# EAGLE design licznik (EAGLE 7.5.0)
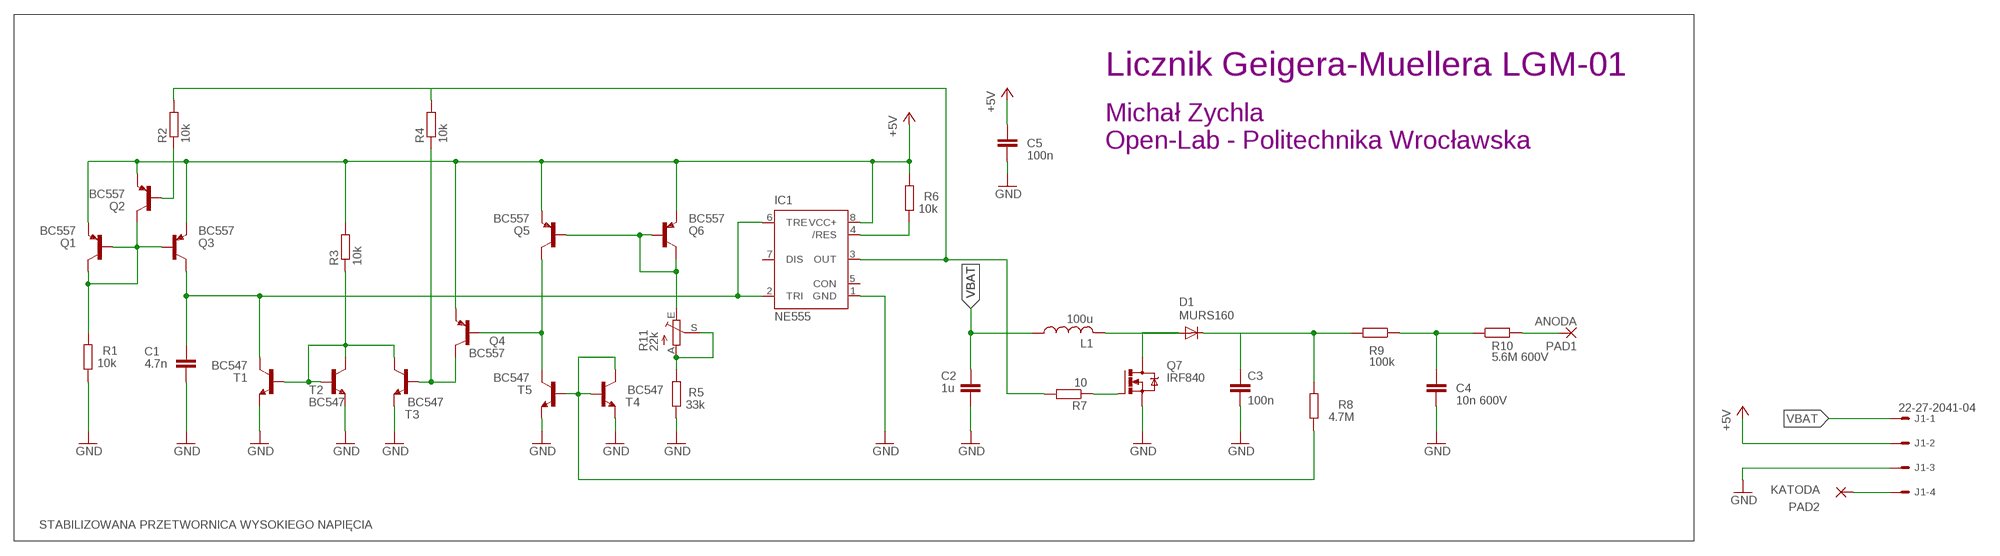
[diagram p0: schematic, sheet 1]

## Parts
C1  4.7n  C5/3  [C5B3]
C2  1u  C5/3  [C5B3]
C3  100n  C-EU075-032X103  [C075-032X103]
C4  10n 600V  C5/3  [C5B3]
C5  100n  C5/3  [C5B3]
D1  MURS160  DIODE-SMB  [SMB]
IC1  NE555  [DIL-08]
J1  22-27-2041-04  [6410-04]
L1  100u  L-USTJ3-U1  [TJ3-U1]
PAD1  ANODA  WIREPAD2,15/1,0  [2,15/1,0]
PAD2  KATODA  WIREPAD2,15/1,0  [2,15/1,0]
Q1  BC557  [TO92]
Q2  BC557  [TO92]
Q3  BC557  [TO92]
Q4  BC557  [TO92]
Q5  BC557  [TO92]
Q6  BC557  [TO92]
Q7  IRF840  IRF740  [TO220BV]
R1  10k  R-EU_0207/10  [0207/10]
R2  10k  R-EU_0207/10  [0207/10]
R3  10k  R-EU_0207/10  [0207/10]
R4  10k  R-EU_0207/10  [0207/10]
R5  33k  R-EU_0207/10  [0207/10]
R6  10k  R-EU_0207/10  [0207/10]
R7  10  R-EU_0207/10  [0207/10]
R8  4.7M  R-EU_0207/10  [0207/10]
R9  100k  R-EU_0207/10  [0207/10]
R10  5.6M 600V  R-EU_0411/12  [0411/12]
R11  22k  TRIM_EU-CA6V  [CA6V]
T1  BC547  [TO92]
T2  BC547  [TO92]
T3  BC547  [TO92]
T4  BC547  [TO92]
T5  BC547  [TO92]

## Nets
+5V: C5.1 IC1.8(VCC+) J1.2 Q1.1(E) Q2.1(E) Q3.1(E) Q4.1(E) Q5.1(E) Q6.1(E) R3.2 R6.2
GND: C1.2 C2.2 C3.2 C4.2 C5.2 IC1.1(GND) J1.3 Q7.S R1.1 R5.1 T1.1(E) T2.1(E) T3.1(E) T4.1(E) T5.1(E)
N$1: C3.1 D1.C R8.2 R9.2
N$2: Q4.3(C) R4.1 T3.2(B)
N$3: IC1.3(OUT) R2.2 R4.2 R7.2
N$4: Q1.2(B) Q1.3(C) Q2.3(C) Q3.2(B) R1.2
N$5: C1.1 IC1.2(TRI) IC1.6(TRE) Q3.3(C) T1.3(C)
N$6: D1.A L1.2 Q7.D
N$7: R3.1 T1.2(B) T2.2(B) T2.3(C) T3.3(C)
N$8: Q2.2(B) R2.1
N$9: Q7.G R7.1
N$10: C4.1 R9.1 R10.1
N$11: Q5.2(B) Q6.2(B) Q6.3(C) R11.E
N$12: R8.1 T4.2(B) T5.2(B) T5.3(C)
N$13: Q4.2(B) Q5.3(C) T4.3(C)
N$14: R5.2 R11.A R11.S
N$16: IC1.4(/RES) R6.1
N$25: PAD1.1(P) R10.2
N$26: J1.4 PAD2.1(P)
VBAT: C2.1 J1.1 L1.1
Unconnected: IC1.5(CON) IC1.7(DIS)

## Notes on the sheet
- Licznik Geigera-Muellera LGM-01
- Michał Zychla
  Open-Lab - Politechnika Wrocławska
- STABILIZOWANA PRZETWORNICA WYSOKIEGO NAPIĘCIA

## Library data of the parts
C1 C2 C4 C5 = capacitor-wima:C: CAPACITOR naming: grid - package width
C3 = rcl:C-EU: CAPACITOR, European symbol
D1 = diode:DIODE-: DIODE
IC1 = st-microelectronics:NE555: General purpose bipolar Timer; MF: Arrow Electronics; MPN: NE555N; OC_FARNELL: 1467742; OC_NEWARK: 89K1486
J1 = con-molex:22-?-04: CONNECTOR wire to board 2.54 mm (.1 inch) pitch header; OC_FARNELL: unknown; OC_NEWARK: unknown
L1 = rcl:L-US: INDUCTOR, American symbol
PAD1 PAD2 = wirepad:WIREPAD: Wire PAD connect wire on PCB
Q1-Q6 = transistor-pnp:BC557: PNP Transistor
Q7 = transistor-power:IRF740: N-CHANNEL MOS FET
R1-R10 = resistor:R-EU_: RESISTOR, European symbol
R11 = pot:TRIM_EU-: POTENTIOMETER
T1-T5 = transistor:BC547: NPN TRANSISTOR

## Board
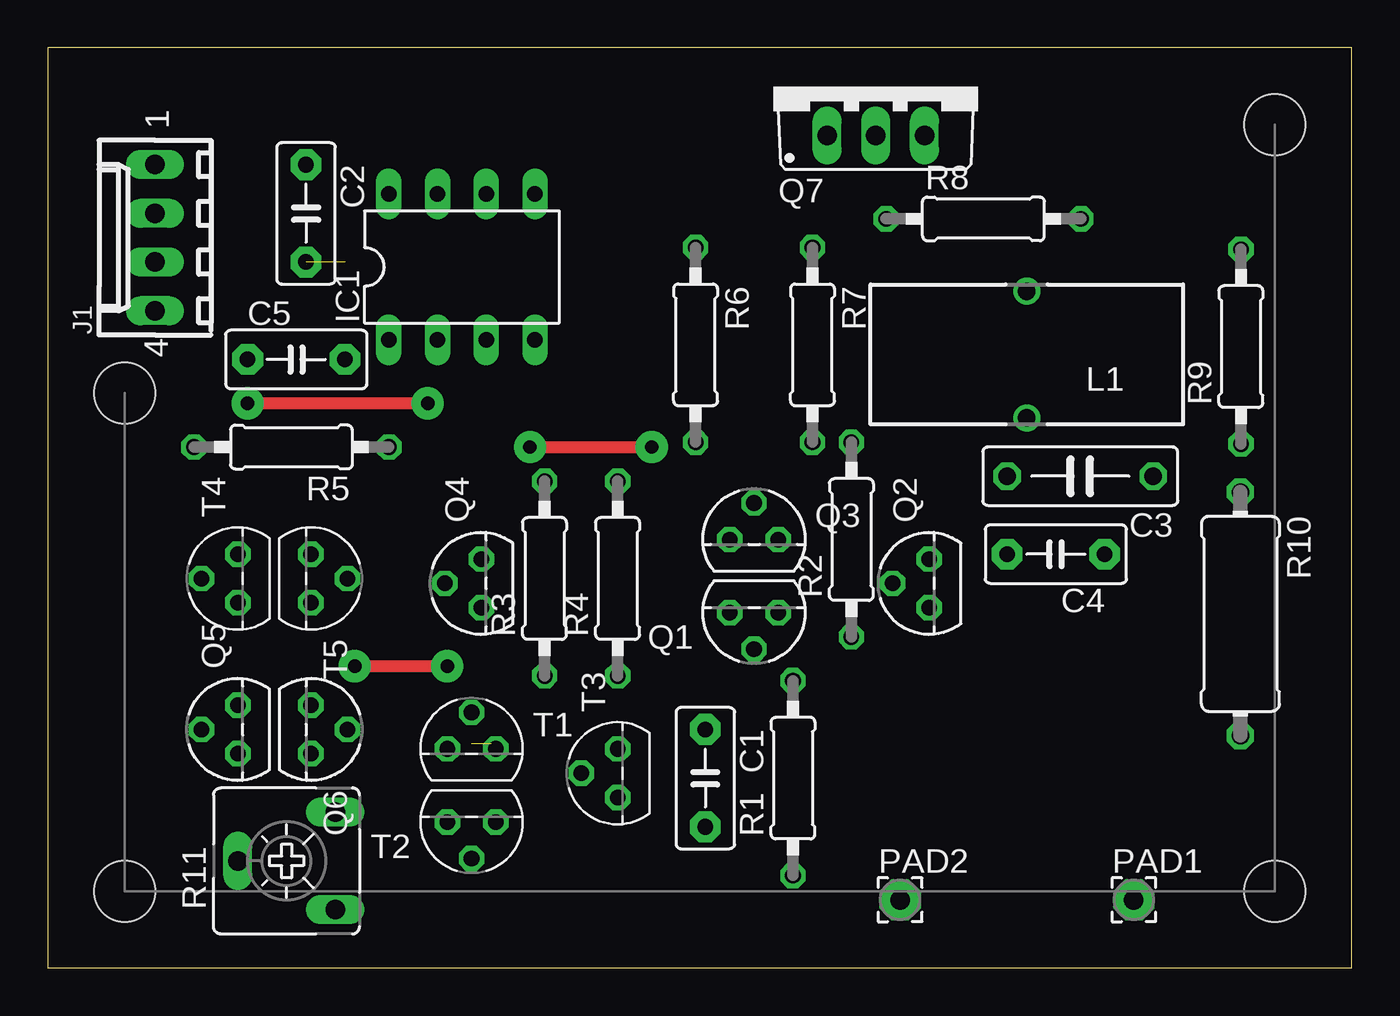
[diagram p1: board, top side]
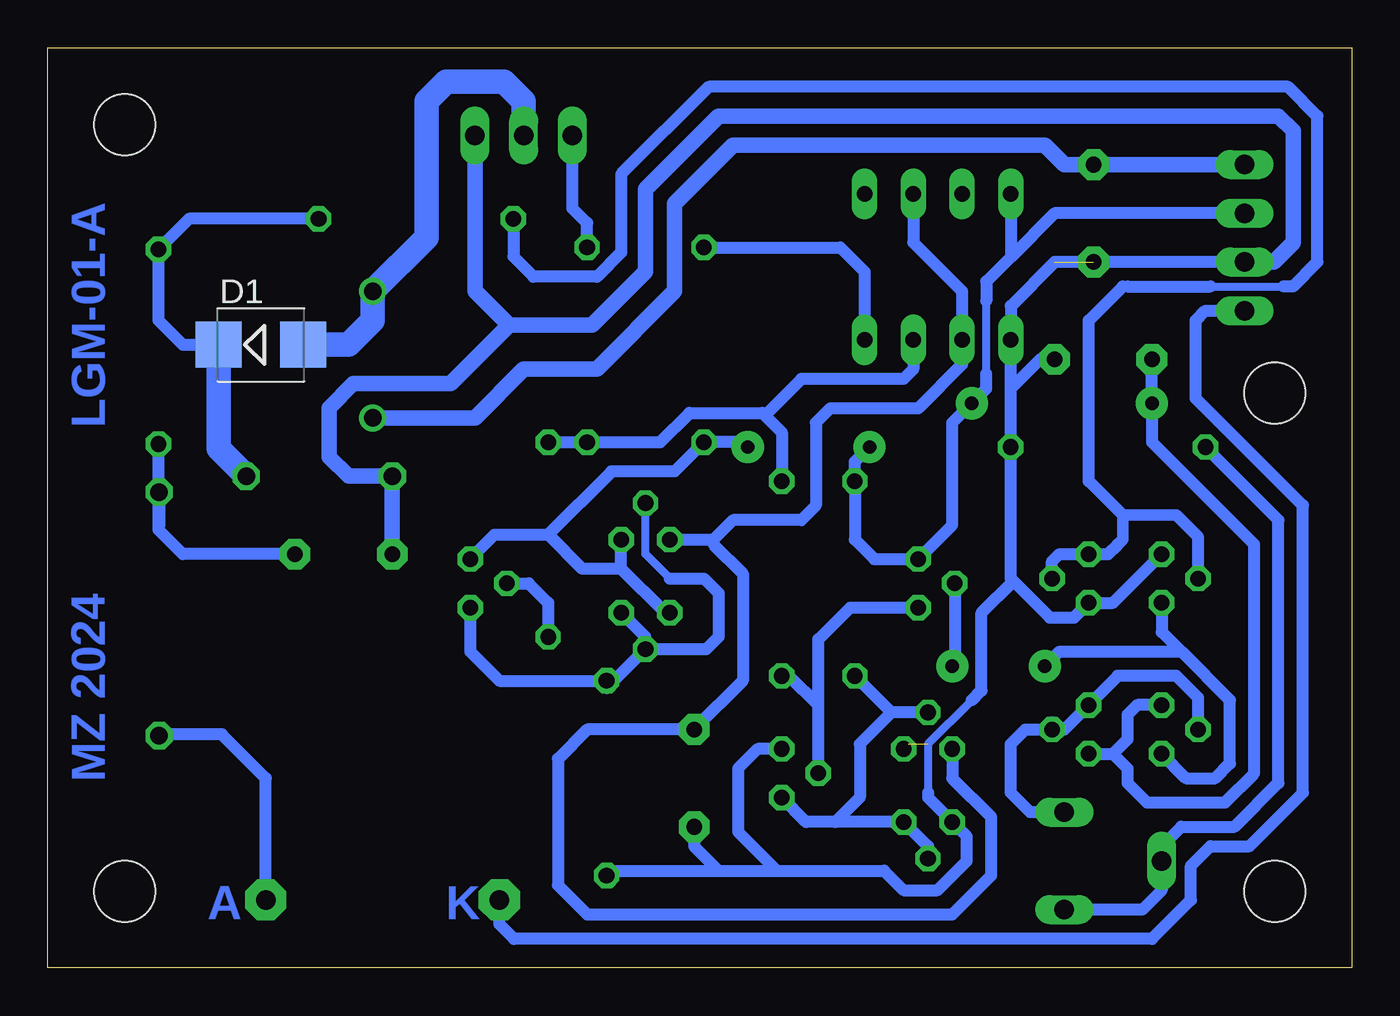
[diagram p2: board, bottom side, seen from below]

Size 68 x 48 mm. Coordinates in mm from the lower left corner, seen from the top.
Outline: 0,0 68,0 68,48 0,48 0,0
Copper layers (1*16): Top 0.035mm / dielectric 1.5mm / Bottom 0.035mm
Design rules "default": minimum track width 10mil, minimum drill 24mil, track to track 8mil, track to pad 8mil, pad to pad 8mil, via to via 8mil, smd to smd 8mil, copper to edge 40mil, drill to drill 8mil, minimum pad ring 10mil, minimum via ring 8mil, stop-mask expansion 4mil, vias tented up to drill 0mil, thermal gap 10mil
Holes 3.2 mm at 4,4 64,44 4,30 64,4

### Footprints (pad centres in the part's own frame; a part is rotated, then mirrored left to right if it is on the bottom)
C5B3 = drill 0.813 pad 1.6 octagon: 1 -2.54,0; 2 2.54,0
C075-032X103 = drill 0.914 octagon: 1 -3.81,0; 2 3.81,0
SMB = smd 2.4 x 2.4: A 2.2,0; C -2.2,0
DIL-08 = drill 0.813 long: 1 -3.81,-3.81; 2 -1.27,-3.81; 3 1.27,-3.81; 4 3.81,-3.81; 5 3.81,3.81; 6 1.27,3.81; 7 -1.27,3.81; 8 -3.81,3.81
6410-04 = drill 1.016 long: 1 3.81,0; 2 1.27,0; 3 -1.27,0; 4 -3.81,0
TJ3-U1 = drill 0.9: 1 -3.3,0; 2 3.3,0
2,15/1,0 = drill 1.016 pad 2.159 octagon: 1 0,0
TO92 = drill 0.813 octagon: 1 1.27,0; 2 0,1.905; 3 -1.27,0
TO220BV = drill 1.016 long: D 0,-2.54; G -2.54,-2.54; S 2.54,-2.54
0207/10 = drill 0.813 octagon: 1 -5.08,0; 2 5.08,0
0411/12 = drill 0.914 octagon: 1 -6.35,0; 2 6.35,0
CA6V = drill 1.016 long: A -2.54,-2.54; E 2.54,-2.54; S 0,2.54

### Placement (x,y rotation side)
C1  34.29,9.91 270 top
C2  13.46,39.37 270 top
C3  53.85,25.65 180 top
C4  52.58,21.59 180 top
C5  12.95,31.75 0 top
D1  56.9,32.51 0 bottom
IC1  21.59,36.58 0 top
J1  5.59,38.1 90 top
L1  51.05,32 90 top
PAD1  56.64,3.56 0 top
PAD2  44.45,3.56 0 top
Q1  36.83,18.54 180 top
Q2  45.97,20.07 90 top
Q3  36.83,22.35 0 top
Q4  22.61,20.07 90 top
Q5  9.91,12.45 90 top
Q6  13.72,12.45 270 top
Q7  43.18,45.97 0 top
R1  38.86,9.91 90 top
R2  41.91,22.35 90 top
R3  25.91,20.32 90 top
R4  29.72,20.32 90 top
R5  12.7,27.18 180 top
R6  33.78,32.51 270 top
R7  39.88,32.51 270 top
R8  48.8,39.08 0 top
R9  62.23,32.42 90 top
R10  62.2,18.48 270 top
R11  12.45,5.59 90 top
T1  22.1,11.43 0 top
T2  22.1,7.62 180 top
T3  29.72,10.16 90 top
T4  9.91,20.32 90 top
T5  13.72,20.32 270 top

### Tracks (layer width: path | path; a pad name or v marks a point on that pad's centre or on a via)
+5V  (via drill 0.6, 0.7 pad 1.68)
  Top 0.635: v25.15,27.18 v31.5,27.18 | v10.41,29.46 v19.81,29.46
  Bottom 0.406: 19.05,30.99 19.05,34.8
  Bottom 0.635: Q5.1 11.18,13.72 11.68,13.21 11.68,11.94 12.45,11.18 | Q6.1 12.45,11.18 | Q1.1 35.81,18.54 38.1,20.83 | 38.1,20.83 Q3.1 | 38.1,20.83 40.13,20.83 41.91,22.61 | Q2.1 44.7,22.61 41.91,22.61 | 41.91,22.61 38.61,25.91 35.31,25.91 R6.2 31.75,27.43 v31.5,27.18 | C5.1 v10.41,29.46 10.41,27.43 5.08,22.1 5.08,10.16 6.6,8.64 10.67,8.64 11.68,9.65 11.68,10.41 12.45,11.18 | 19.05,34.8 19.05,35.81 17.78,37.08 | 19.05,30.99 19.05,30.23 v19.81,29.46 20.83,28.45 20.83,23.11 Q4.1 24.89,21.34 25.91,22.35 R3.2 25.91,26.42 v25.15,27.18 | IC1.8 17.78,37.08 | J1.2 15.49,39.37 17.78,37.08
GND  (2 unrouted)
  Bottom 0.406: 19.81,13.97 22.1,11.68 22.1,9.14
  Bottom 0.635: T4.1 12.45,19.05 T5.1 14.48,18.29 15.75,18.29 17.65,20.19 | 23.11,11.68 T1.1 | 17.65,20.19 17.78,20.32 R5.1 17.78,30.23 | 17.65,20.19 19.3,18.54 19.3,14.48 19.81,13.97 | 17.78,30.23 IC1.1 17.78,34.54 15.49,36.83 J1.3 | 33.02,5.08 29.97,5.08 | 29.97,5.08 24.38,5.08 23.37,4.06 21.59,4.06 20.07,5.59 20.07,6.86 T2.1 22.1,8.89 22.1,9.14 | C1.2 34.29,6.35 33.02,5.08 | R1.1 38.61,5.08 33.02,5.08 | T3.1 30.99,11.43 32,10.41 32,7.11 29.97,5.08 | C5.2 16.26,31.75 17.78,30.23
  Bottom 0.813: Q7.S 45.72,35.31 43.94,33.53 | C4.2 C3.2 52.32,25.65 53.34,26.67 53.34,29.21 52.07,30.48 46.99,30.48 43.94,33.53 | J1.3 4.06,36.83 3.05,37.85 3.05,43.69 3.81,44.45 33.02,44.45 36.83,40.64 36.83,36.32 39.62,33.53 43.94,33.53
N$1
  Bottom 0.635: R9.2 62.23,33.78 60.96,32.51 D1.C | 62.17,37.56 R9.2 | R8.2 60.64,39.08 R9.2
  Bottom 1.27: D1.C 59.1,27.09 C3.1
N$2
  Bottom 0.635: Q4.3 26.16,18.8 27.81,17.14 27.81,13.72 | T3.2 27.81,13.72 | R4.1 29.34,15.24 27.81,13.72
N$3
  Bottom 0.635: R2.2 R7.2 36.07,27.43 34.54,28.96 30.73,28.96 30.61,28.83 | 30.61,28.83 29.72,27.94 R4.2 | IC1.3 22.86,31.24 23.37,30.73 28.7,30.73 30.61,28.83
N$4
  Bottom 0.406: 35.56,20.32 36.83,21.59 Q3.2
  Bottom 0.635: 35.56,20.32 33.78,20.32 33.02,19.56 33.02,17.27 33.66,16.64 Q1.2 | Q1.2 36.83,17.27 Q1.3 | Q1.2 38.86,14.61 R1.2 44.45,14.99 45.97,16.51 Q2.3
N$5
  Bottom 0.635: Q3.3 33.27,22.35 | IC1.6 22.86,37.85 20.32,35.31 IC1.2 20.32,31.5 22.61,29.21 27.18,29.21 27.94,28.45 27.94,24.13 28.7,23.37 32.26,23.37 33.27,22.35 | 33.27,22.35 33.27,22.1 31.75,20.57 31.75,14.99 C1.1 39.88,12.45 41.4,10.92 41.4,4.32 39.88,2.79 20.83,2.79 18.8,4.83 18.8,7.87 20.83,9.91 T1.3
N$6
  Bottom 1.27: L1.2 | L1.2 48.26,38.1 48.26,45.21 47.24,46.23 44.2,46.23 43.18,45.21 Q7.D | D1.A 52.32,32.51 51.05,33.78 L1.2
N$7
  Bottom 0.635: T2.2 22.1,6.35 T2.3 26.92,7.62 | 26.92,7.62 28.45,7.62 T3.3 | T1.2 24,13.34 | 24,13.34 25.65,11.68 25.65,8.89 26.92,7.62 | R3.1 24,13.34
N$8
  Bottom 0.635: Q2.2 42.93,20.07 41.91,19.05 R2.1
N$9
  Bottom 0.635: R7.1 39.88,38.86 40.64,39.62 Q7.G
N$10
  Bottom 0.635: 62.23,23 62.23,22.86 60.96,21.59 C4.1 | 62.23,23 R9.1 | R10.1 62.2,23.03 62.23,23
N$11
  Bottom 0.635: Q6.2 14.99,12.45 Q6.3 12.19,15.24 9.14,15.24 8,14.1 Q5.2 | Q6.2 15.62,12.83 | R11.E 16.76,8.13 17.78,9.14 17.78,11.68 17.02,12.45 Q6.2
N$12
  Bottom 0.406: 11.94,35.56 11.68,35.56 | 7.37,35.56 3.56,35.56
  Bottom 0.61: 9.14,23.62 11.94,23.62 | 11.94,23.62 13.72,25.4 | 12.19,22.1 11.94,22.35 11.94,23.62
  Bottom 0.635: T4.2 8,22.48 9.14,23.62 | 13.72,25.4 13.72,33.78 11.94,35.56 | 3.56,35.56 3.05,35.56 1.78,36.83 1.78,44.45 3.3,45.97 33.53,45.97 38.1,41.4 38.1,37.34 39.37,36.07 42.67,36.07 43.72,37.12 R8.1 | 11.68,35.56 7.37,35.56 | T5.2 15.62,21.21 15.24,21.59 T5.3 12.7,21.59 12.19,22.1
N$13  (via drill 0.6, 0.7 pad 1.68)
  Top 0.635: v16,15.75 v20.83,15.75
  Bottom 0.635: 8.89,16.51 9.91,17.53 T4.3 | 8.89,16.51 6.35,13.97 6.35,10.67 7.11,9.91 8.64,9.91 Q5.3 | 20.57,20.32 20.57,20.19 Q4.2 20.7,15.88 v20.83,15.75 | v16,15.75 15.24,16.51 8.89,16.51
N$14
  Bottom 0.635: R11.A 10.92,3.05 9.91,4.06 R11.S 9.91,6.35 8.89,7.37 6.1,7.37 3.81,9.65 3.81,23.37 R5.2
N$16
  Bottom 0.635: R6.1 26.67,37.59 25.4,36.32 IC1.4
N$25
  Bottom 0.635: PAD1.1 56.64,9.91 58.93,12.19 62.13,12.19 R10.2
N$26
  Bottom 0.635: J1.4 7.62,34.29 8.13,33.78 8.13,29.72 2.54,24.13 2.54,9.14 5.33,6.35 7.37,6.35 8.38,5.33 8.38,3.56 10.41,1.52 43.69,1.52 44.45,2.29 PAD2.1
VBAT
  Bottom 0.813: J1.1 C2.1 14.99,41.91 16,42.93 32.26,42.93 35.31,39.88 35.31,35.31 39.37,31.24 43.18,31.24 45.72,28.7 L1.1

### Text on the board
Bottom: LGM-01-A | MZ 2024 | K | A